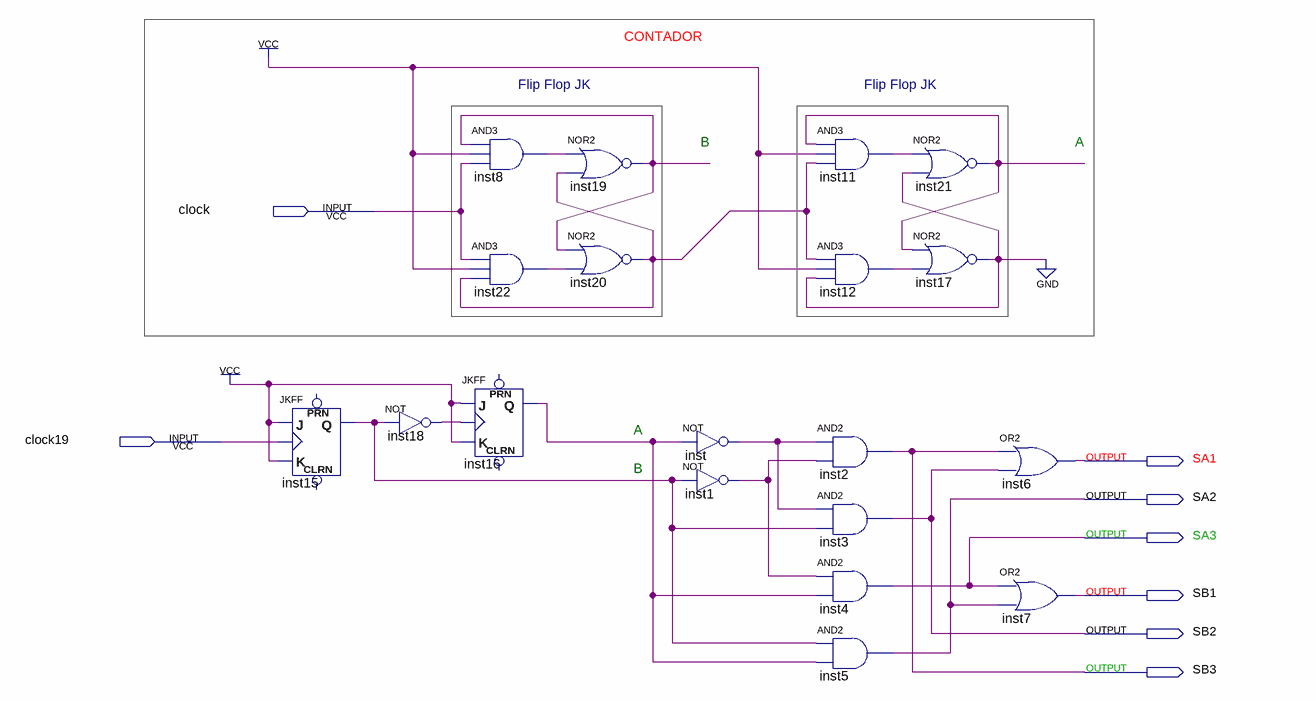
[diagram p0: schematic sheet]
// Quartus schematic semaforo_contador_conceito.bdf as structural Verilog: 19 symbols, 8 pins
module semaforo_contador_conceito (
  input  clock,
  input  clock19,
  output SA1,
  output SA2,
  output SA3,
  output SB1,
  output SB2,
  output SB3
);

  wire inst1_out, inst8_out, inst11_out, inst12_out, inst15_q, inst16_q, inst17_out, inst18_out, inst19_out,
       inst20_out, inst21_out, inst22_out, inst_out;

  JKFF inst15 (.K(1'b1), .J(1'b1), .CLK(clock19), .Q(inst15_q));  // open: PRN, CLRN
  not inst18 (inst18_out, inst15_q);
  and inst8 (inst8_out, inst19_out, 1'b1, clock);
  and inst22 (inst22_out, clock, 1'b1, inst20_out);
  JKFF inst16 (.K(1'b1), .J(1'b1), .CLK(inst18_out), .Q(inst16_q));  // open: PRN, CLRN
  nor inst19 (inst19_out, inst8_out, inst20_out);
  nor inst20 (inst20_out, inst19_out, inst22_out);
  not inst (inst_out, inst16_q);
  not inst1 (inst1_out, inst15_q);
  and inst11 (inst11_out, inst21_out, 1'b1, inst20_out);
  and inst12 (inst12_out, inst20_out, 1'b1, inst17_out);
  and inst2 (SB3, inst_out, inst1_out);
  and inst3 (SB2, inst_out, inst15_q);
  and inst4 (SA3, inst1_out, inst16_q);
  and inst5 (SA2, inst15_q, inst16_q);
  nor inst21 (inst21_out, inst11_out, inst17_out);
  nor inst17 (inst17_out, inst21_out, inst12_out);
  or inst6 (SA1, SB3, SB2);
  or inst7 (SB1, SA3, SA2);
  // also tied to GND on the sheet: inst17_out

  // Notes on the sheet:
  //   CONTADOR
  //   Flip Flop JK
  //   Flip Flop JK
  //   B
  //   A
  //   A
  //   B
endmodule
